# EAGLE design MEGA2560_Rev3e (EAGLE 9.6.2)

## Sheet 1 of 2
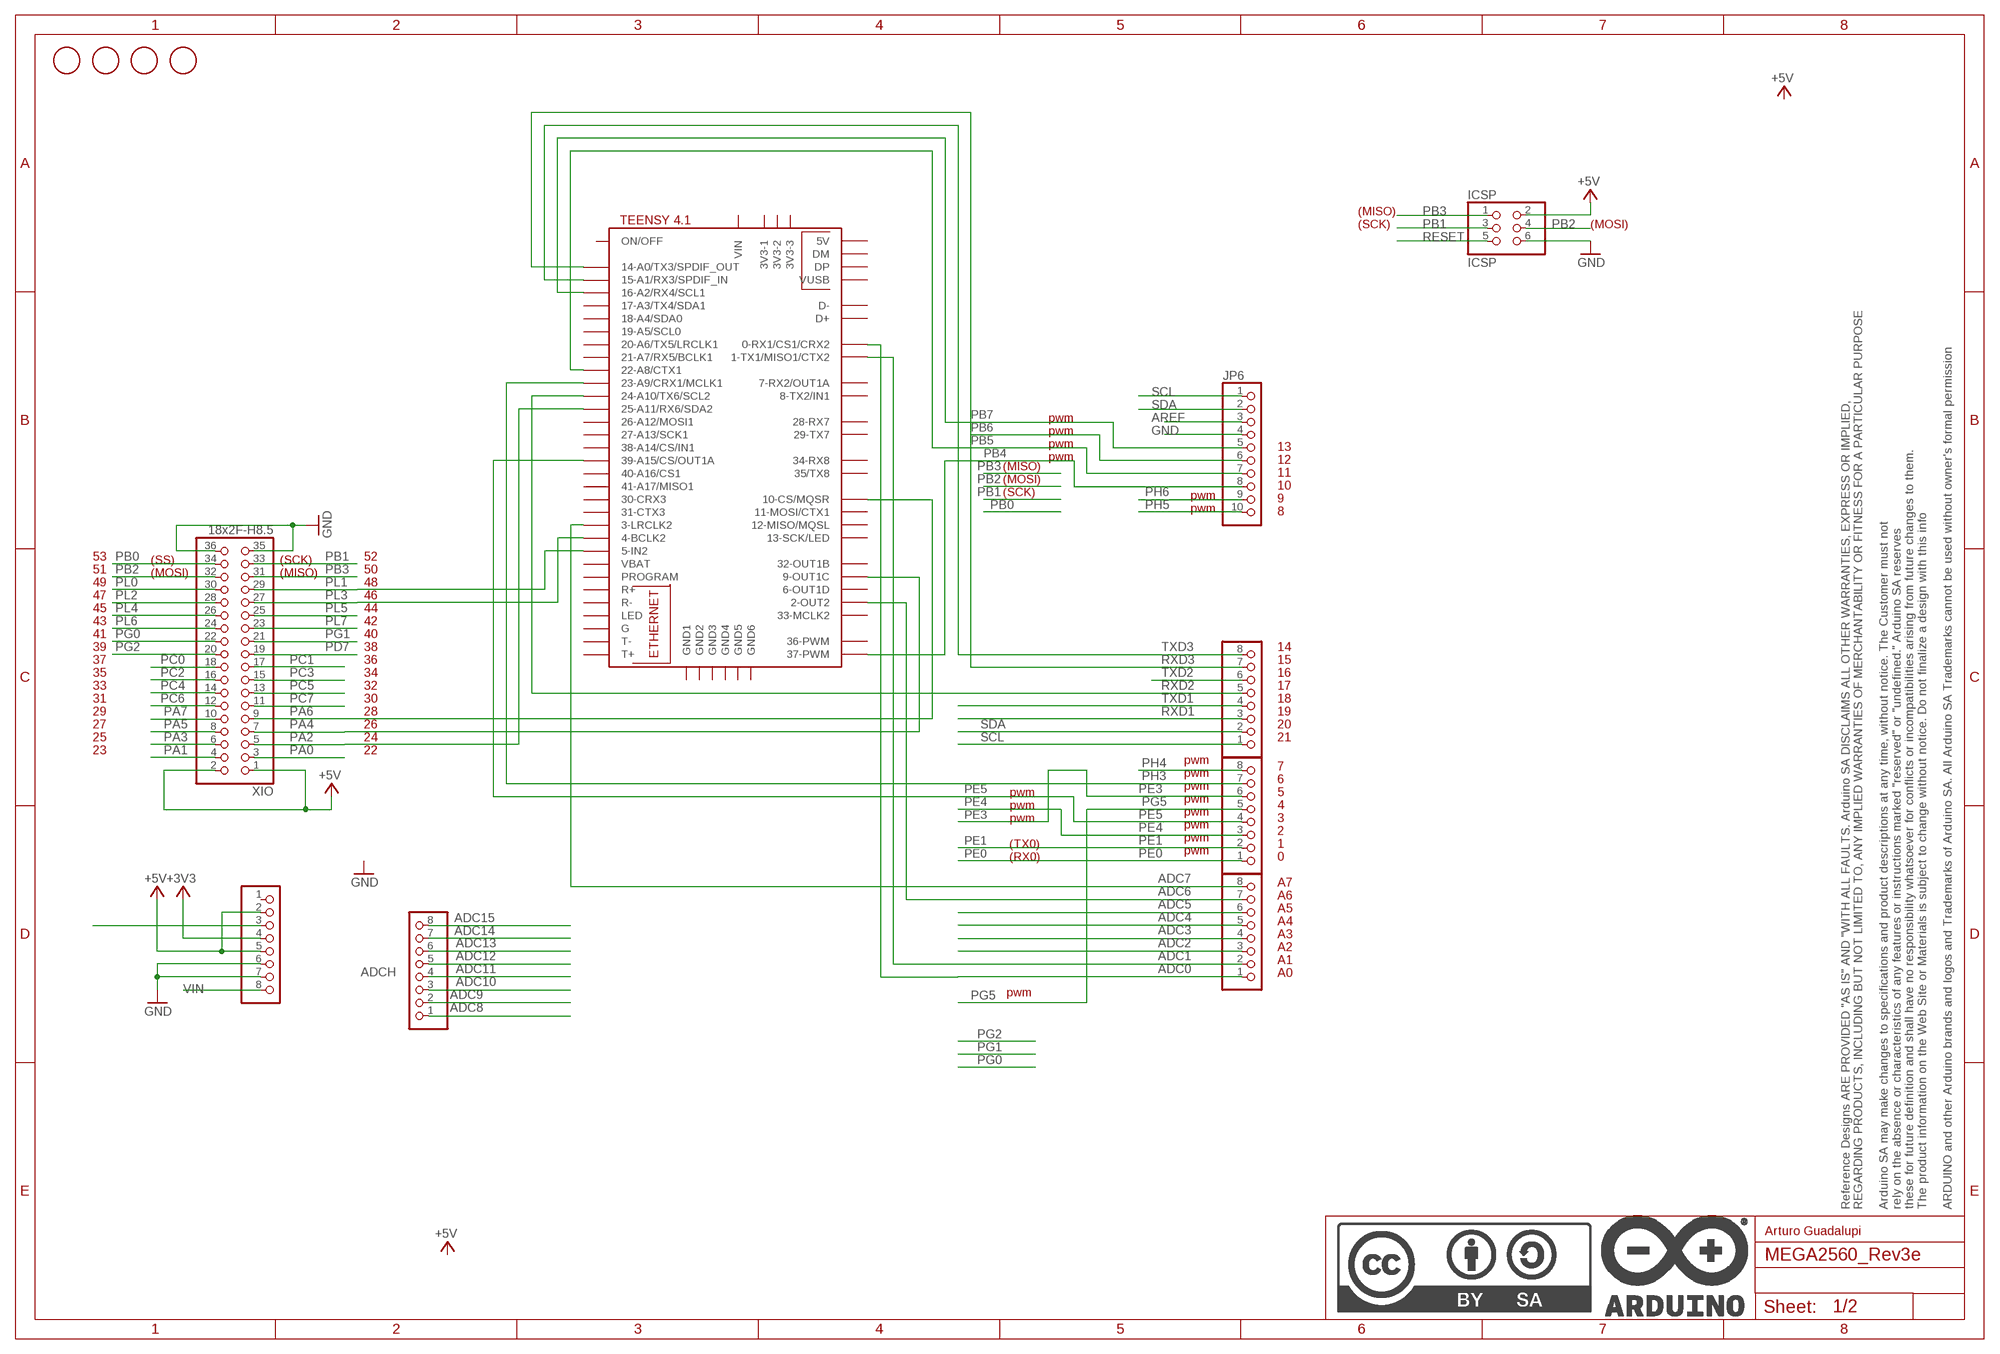
[diagram p0: schematic, sheet 1]

### Parts
ADCH  FH254-108DF08500V  0058_FH254-108DF08500V  [1X08]
ADCL  FH254-108DF08500V  0058_FH254-108DF08500V  [1X08]
COMMUNICATION  FH254-108DF08500V  0058_FH254-108DF08500V  [1X08]
FD1  FIDUCIALMOUNT  [FIDUCIA-MOUNT]
FD2  FIDUCIALMOUNT  [FIDUCIA-MOUNT]
FD3  FIDUCIALMOUNT  [FIDUCIA-MOUNT]
FD4  FIDUCIALMOUNT  [FIDUCIA-MOUNT]
ICSP  ICSP  0114_PH254-203DF118A00V  [2X03]
JP6  FH254-110DF08500V  1216_FH254-110DF08500T30  [1X10]
POWER  FH254-108DF08500V  1217_FH254-108DF08500T21  [1X08]
PWML  FH254-108DF08500V  1218_FH254-108DF08500T20  [1X08]
U$1  DNP  A3-FRAME  [FRAME]
U$3  TEENSY41  [TEENSY41]
XIO  18x2F-H8.5  0060_FH254-218DF08500V  [2X18]

### Nets
+3V3 [power]: POWER.4
+5V [power usb]: ICSP.2 POWER.2 POWER.5 XIO.1 XIO.2 ; also sheet 2
ADC0: ADCL.1 U$3.0-RX1/CS1/CRX2
ADC1: ADCL.2 U$3.1-TX1/MISO1/CTX2
ADC2: ADCL.3
ADC3: ADCL.4
ADC4: ADCL.5
ADC5: ADCL.6
ADC6: ADCL.7 U$3.2-OUT2
ADC7: ADCL.8 U$3.3-LRCLK2
ADC8: ADCH.1
ADC9: ADCH.2
ADC10: ADCH.3
ADC11: ADCH.4
ADC12: ADCH.5
ADC13: ADCH.6
ADC14: ADCH.7
ADC15: ADCH.8
AREF: JP6.3
GND [gnd]: ICSP.6 JP6.4 POWER.6 POWER.7 XIO.35 XIO.36 ; also sheet 2
PA0: XIO.3
PA1: XIO.4
PA2: U$3.25-A11/RX6/SDA2 XIO.5
PA3: XIO.6
PA4: U$3.9-OUT1C XIO.7
PA5: XIO.8
PA6: U$3.10-CS\MQSR(10-CS/MQSR) XIO.9
PA7: XIO.10
PB0: XIO.34
PB1: ICSP.3 XIO.33
PB2: ICSP.4 XIO.32
PB3: ICSP.1 XIO.31
PB4: JP6.8 U$3.37-PWM
PB5: JP6.7 U$3.22-A8/CTX1
PB6: JP6.6
PB7: JP6.5 U$3.16-A2/RX4/SCL1
PC0: XIO.18
PC1: XIO.17
PC2: XIO.16
PC3: XIO.15
PC4: XIO.14
PC5: XIO.13
PC6: XIO.12
PC7: XIO.11
PD7: XIO.19
PE0: PWML.1
PE1: PWML.2
PE3: PWML.6
PE4: PWML.3
PE5: PWML.4 U$3.39-A15/CS/OUT1A
PG0: XIO.22
PG1: XIO.21
PG2: XIO.20
PG5: PWML.5
PH3: PWML.7 U$3.23-A9/CRX1/MCLK1
PH4: PWML.8
PH5: JP6.10
PH6: JP6.9
PL0: XIO.30
PL1: U$3.5-IN2 XIO.29
PL2: XIO.28
PL3: U$3.4-BCLK2 XIO.27
PL4: XIO.26
PL5: XIO.25
PL6: XIO.24
PL7: XIO.23
RESET: ICSP.5 POWER.3
RXD1: COMMUNICATION.3
RXD2: COMMUNICATION.5 U$3.24-A10/TX6/SCL2
RXD3: COMMUNICATION.7 U$3.14-A0/TX3/SPDIF_OUT
SCL: COMMUNICATION.1 JP6.1
SDA: COMMUNICATION.2 JP6.2
TXD1: COMMUNICATION.4
TXD2: COMMUNICATION.6
TXD3: COMMUNICATION.8 U$3.15-A1/RX3/SPDIF_IN
VIN [power]: POWER.8
Unconnected: POWER.1 U$3.3V3-1 U$3.3V3-2 U$3.3V3-3 U$3.6-OUT1D U$3.7-RX2/OUT1A U$3.8-TX2/IN1 U$3.11-MOSI/CTX1 U$3.12-MISO/MQSL U$3.13-SCK/LED U$3.17-A3/TX4/SDA1 U$3.18-A4/SDA0 U$3.19-A5/SCL0 U$3.20-A6/TX5/LRCLK1 U$3.21-A7/RX5/BCLK1 U$3.26-A12/MOSI1 U$3.27-A13/SCK1 U$3.28-RX7 U$3.29-TX7 U$3.30-CRX3 U$3.31-CTX3 U$3.32-OUT1B U$3.33-MCLK2 U$3.34-RX8 U$3.35-TX8(35/TX8) U$3.36-PWM U$3.38-A14/CS/IN1 U$3.40-A16/CS1 U$3.41-A17/MISO1 U$3.+5V(5V) U$3.D+ U$3.D- U$3.DM U$3.DP U$3.G U$3.GND1 U$3.GND2 U$3.GND3 U$3.GND4 U$3.GND5 U$3.GND6 U$3.LED U$3.ON/OFF U$3.PROGRAM U$3.R+ U$3.R- U$3.T+ U$3.T- U$3.VBAT U$3.VIN U$3.VUSB

### Notes on the sheet
- (MISO)
- (SCK) | (MOSI)
- pwm
- pwm
- pwm | 13
- pwm | 12
- (MISO)
- 11
- (MOSI)
- 10
- (SCK) | pwm
- 9
- pwm | 8
- 53 | (SS) | (SCK) | 52
- 51 | (MOSI) | (MISO) | 50
- 49 | 48
- 47 | 46
- 45 | 44
- 43 | 42
- 41 | 40
- 39 | 38 | 14
- 37 | 36 | 15
- 35 | 34 | 16
- 33 | 32 | 17
- 31 | 30 | 18
- 29 | 28 | 19
- 27 | 26 | 20
- 25 | 24 | 21
- 23 | 22
- pwm
- 7
- pwm
- 6
- pwm
- pwm | 5
- pwm
- pwm | 4
- pwm
- pwm | 3
- pwm
- 2
- pwm
- (TX0) | 1
- pwm
- (RX0) | 0
- A7
- A6
- A5
- A4
- A3
- A2
- A1
- A0
- pwm
- Arturo Guadalupi

## Sheet 2 of 2
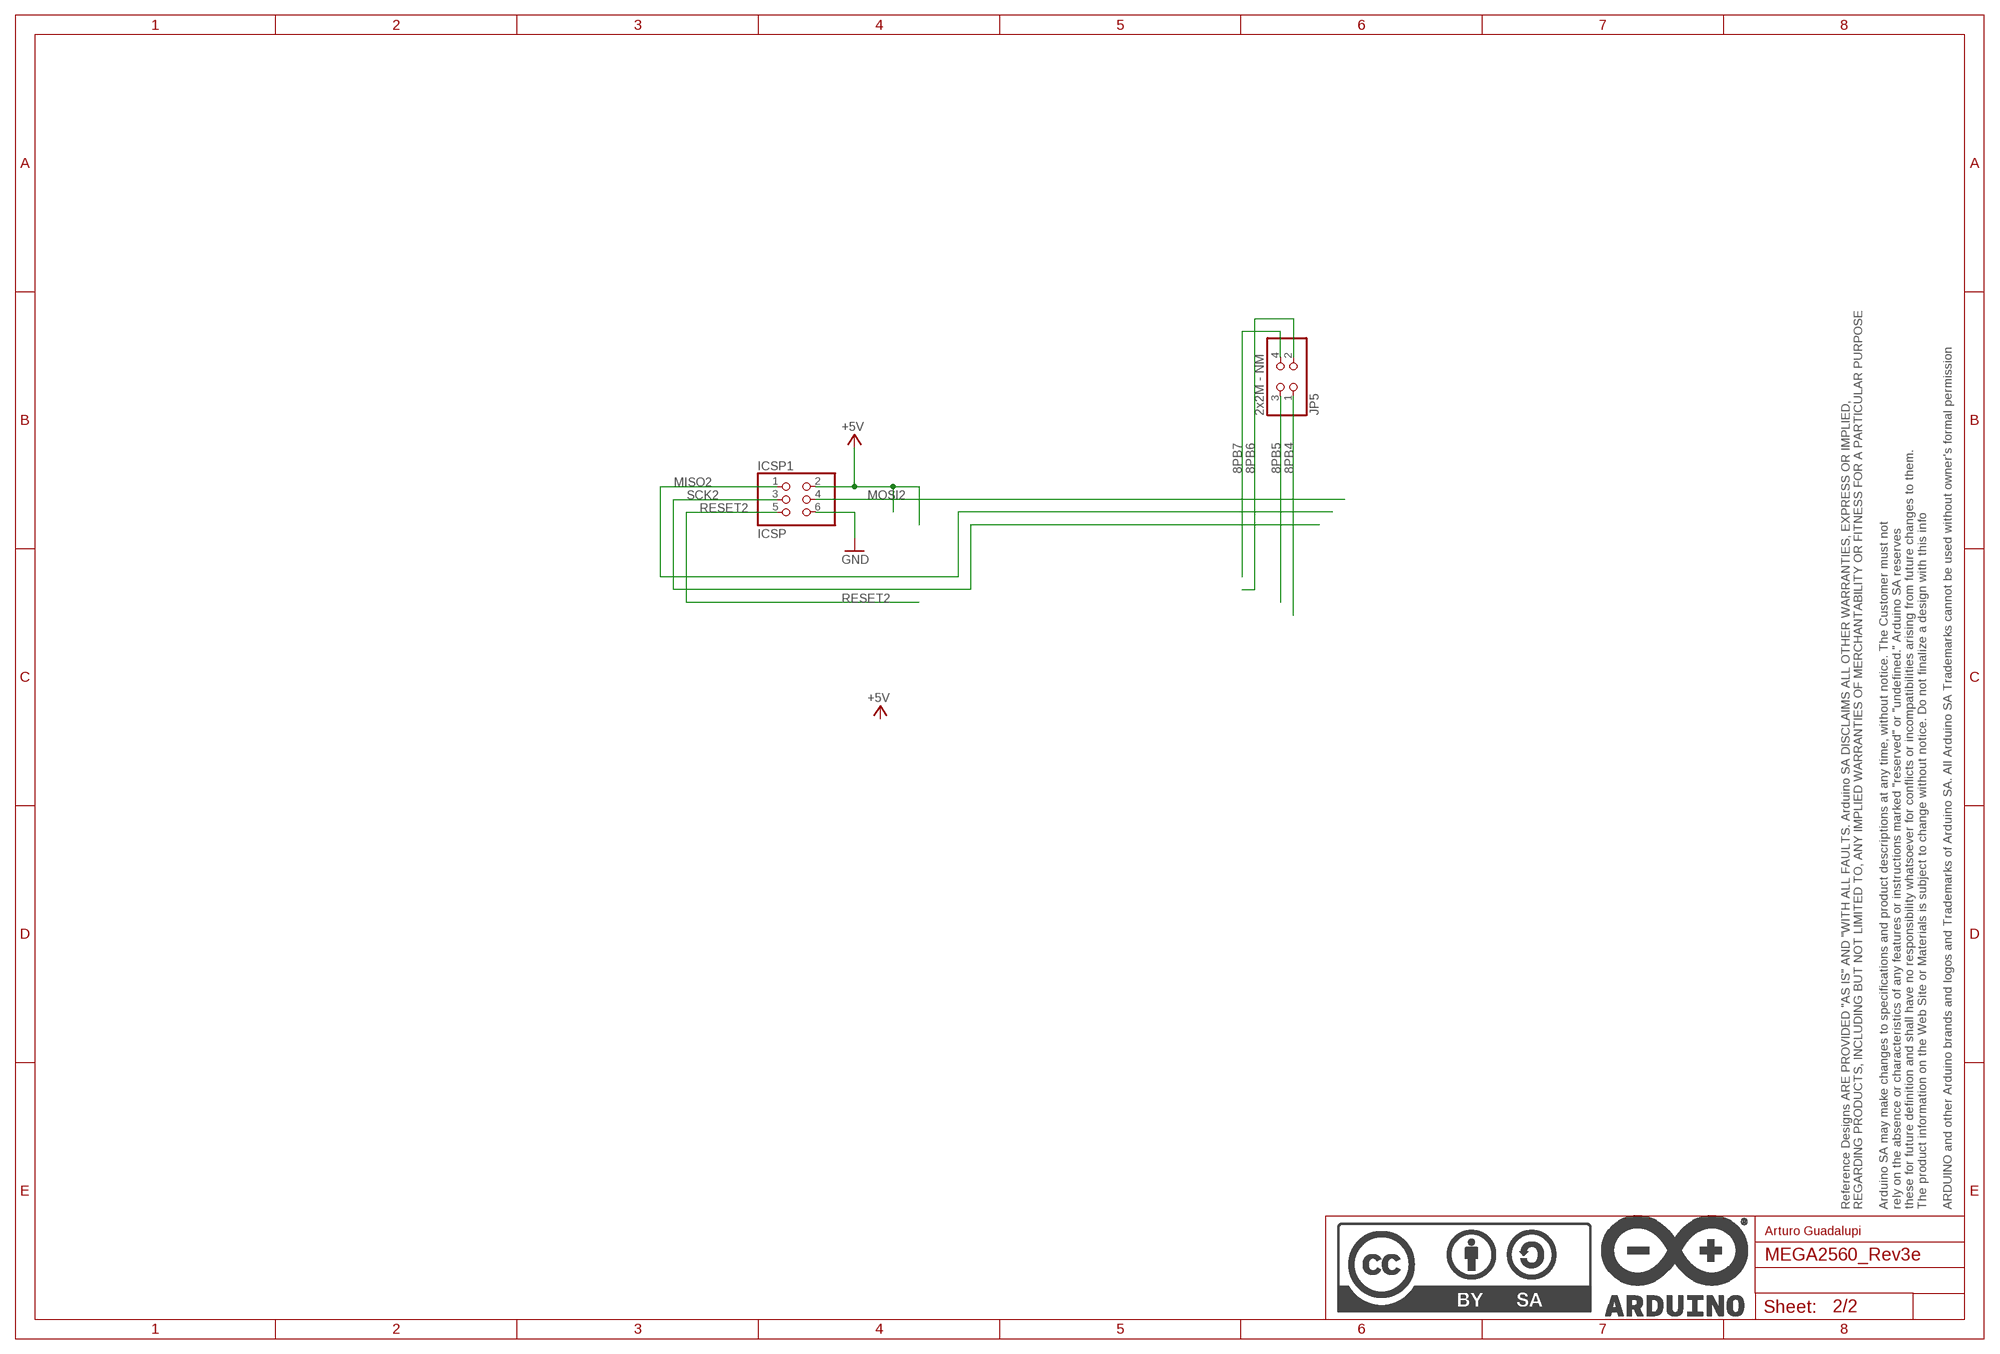
[diagram p1: schematic, sheet 2]

### Parts
ICSP1  ICSP  0114_PH254-203DF118A00V  [2X03]
JP5  2x2M - NM  PINHD-2X2  [2X02]
U$2  DNP  A3-FRAME  [FRAME]

### Nets
8PB4: JP5.1
8PB5: JP5.3
8PB6: JP5.2
8PB7: JP5.4
+5V [power usb]: ICSP1.2 ; also sheet 1
GND [gnd]: ICSP1.6 ; also sheet 1
MISO2: ICSP1.1
MOSI2: ICSP1.4
RESET2: ICSP1.5
SCK2: ICSP1.3

### Notes on the sheet
- Arturo Guadalupi

## Library data of the parts
ADCH ADCL COMMUNICATION = Connettori:0058_FH254-108DF08500V: Female Connector strip for Arduino bases - 8x1 F V h 8,5 p2,54mm; MONTHLY_USAGE: _____; PART_NUMBER: FH254-108DF08500V; PRICE: _____; SUPPLIER: _____; TYPE: Connettori
FD1-FD4 = SmartPrj:FIDUCIALMOUNT
ICSP ICSP1 = Connettori:0114_PH254-203DF118A00V: 3x2 M V h 8,5 mm p2,54; MONTHLY_USAGE: _____; PART_NUMBER: PH254-203DF118A00V; PRICE: _____; SUPPLIER: _____; TYPE: Connettori
JP5 = SmartPrj:PINHD-2X2: PIN HEADER
JP6 = Connettori:1216_FH254-110DF08500T30: Female Connector strip for Arduino bases - 10x1 F V h 8,5 p2,54 serigrafato STRISCIA VUOTA; MONTHLY_USAGE: _____; PART_NUMBER: FH254-110DF08500T30; PRICE: _____; SUPPLIER: _____; TYPE: Connettori; VALUE: FH254-110DF08500T30
POWER = Connettori:1217_FH254-108DF08500T21: Female Connector strip for Arduino bases - 8x1 F V h 8,5 p2,54 serigrafato POWER; MONTHLY_USAGE: _____; PART_NUMBER: FH254-108DF08500T21; PRICE: _____; SUPPLIER: _____; TYPE: Connettori; VALUE: FH254-108DF08500T21
PWML = Connettori:1218_FH254-108DF08500T20: Female Connector strip for Arduino bases - 8x1 F V h 8,5 p2,54 serigrafato DIGITAL; MONTHLY_USAGE: _____; PART_NUMBER: FH254-108DF08500T20; PRICE: _____; SUPPLIER: _____; TYPE: Connettori; VALUE: FH254-108DF08500T20
U$1 U$2 = Arduino-utility:A3-FRAME; CODE-ARDUINO: DNP; DATASHEET: DNP; DISTRIBUTOR-LINK: DNP; DISTRIBUTOR-PN: DNP; MANUFACTURER: DNP; MANUFACTURER-PN: DNP; NOTE: DNP
U$3 = teensy:TEENSY41
XIO = Connettori:0060_FH254-218DF08500V: 18x2 F V h 8,5 p2,54; MONTHLY_USAGE: _____; PART_NUMBER: FH254-218DF08500V; PRICE: _____; SUPPLIER: _____; TYPE: Connettori

## Net classes
0 default: width 0.203 mm, drill 0.406 mm, clearance 0.203 mm
1 power: width 0.61 mm, drill 0.406 mm, clearance 0.203 mm
2 gnd: width 0.305 mm, drill 0.406 mm, clearance 0.203 mm
3 power usb: width 0.508 mm, drill 0.406 mm, clearance 0.203 mm

## Board
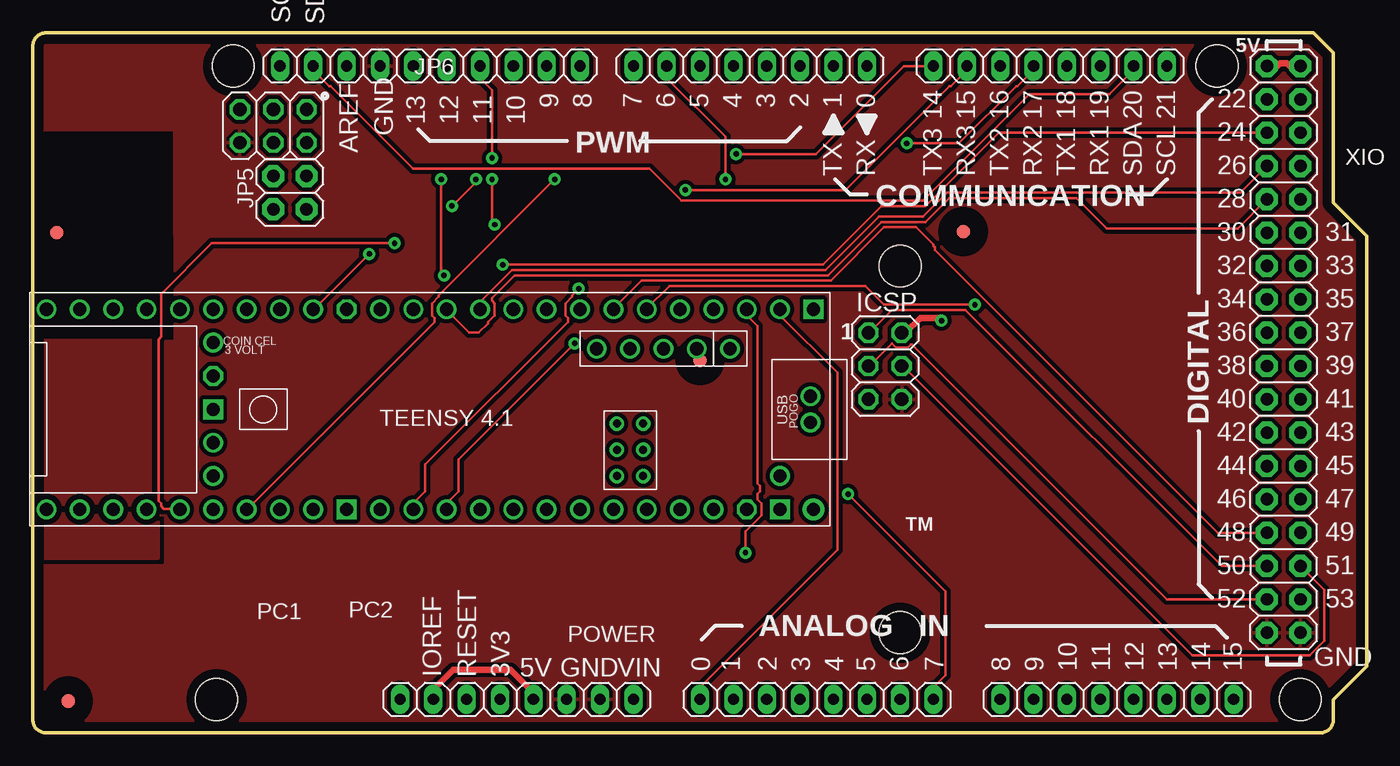
[diagram p2: board, top side]
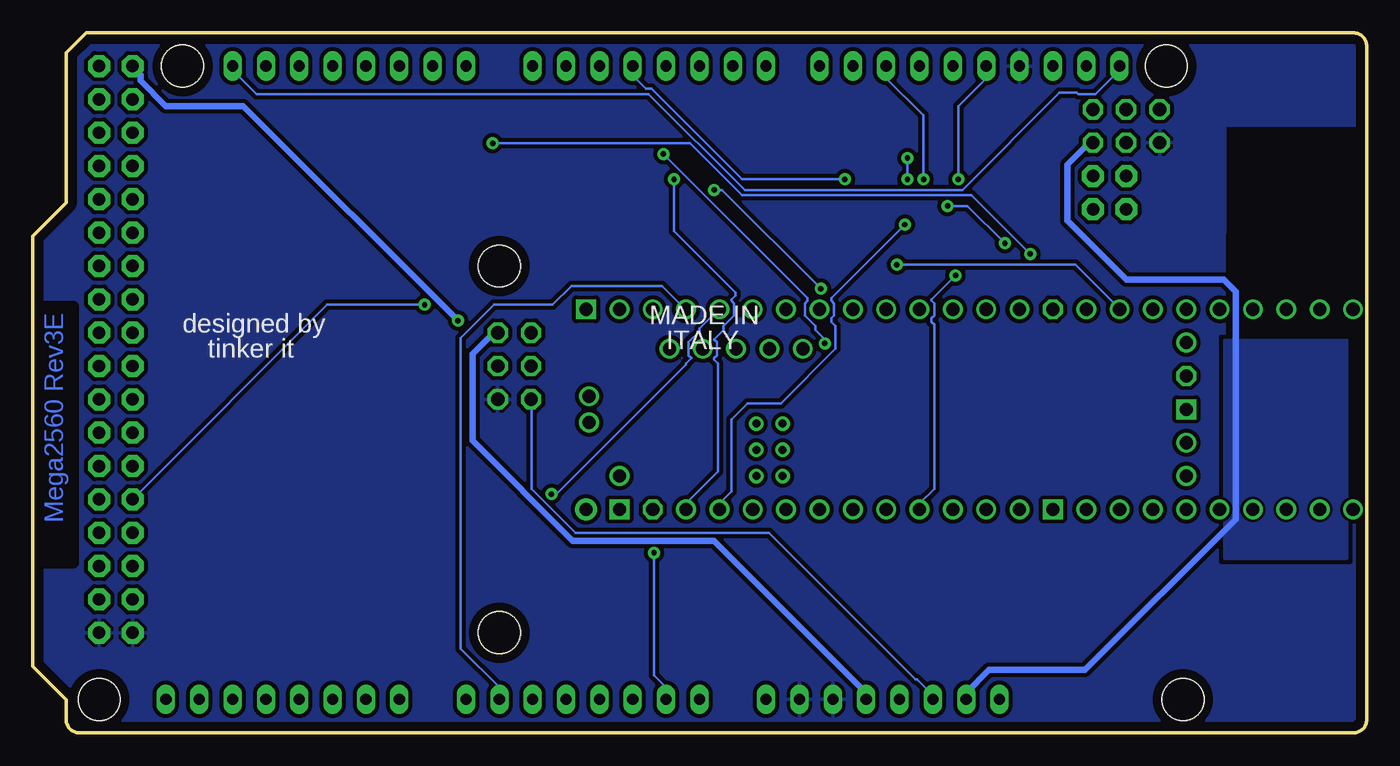
[diagram p3: board, bottom side, seen from below]

Size 101.6 x 53.34 mm. Coordinates in mm from the lower left corner, seen from the top.
Outline: 97.54,53.34 99.06,51.82 99.06,40.39 101.6,37.85 101.6,5.08 99.06,2.54 99.06,1 arc-90 98.06,0 1,0 arc-90 0,1 0,52.34 arc-90 1,53.34 97.54,53.34
Copper layers (1*16): Top 0.035mm / dielectric 1.5mm / Bottom 0.035mm
Design rules "ArduinoMega *": minimum track width 8mil, minimum drill 16mil, track to track 7mil, track to pad 7mil, pad to pad 8mil, via to via 10mil, smd to smd 7mil, copper to edge 27mil, drill to drill 12mil, minimum pad ring 10mil, minimum via ring 10mil, stop-mask expansion 2mil, vias tented up to drill 24mil, thermal gap 10mil
Holes 3.2 mm at 96.55,2.55 15.27,50.81 90.2,50.81 14,2.55 66.07,35.57 66.07,7.63
tRestrict: area 42.5,37.2 to 42.9,37.4
bRestrict: 3 lines

### Footprints (pad centres in the part's own frame; a part is rotated, then mirrored left to right if it is on the bottom)
1X08 = drill 0.85 pad 1.422 long: 1 -8.89,0; 2 -6.35,0; 3 -3.81,0; 4 -1.27,0; 5 1.27,0; 6 3.81,0; 7 6.35,0; 8 8.89,0
FIDUCIA-MOUNT = smd 1.016 x 1.016: P$1 0,0
2X03 = drill 1.016 pad 1.55 octagon: 1 -2.54,-1.27; 2 -2.54,1.27; 3 0,-1.27; 4 0,1.27; 5 2.54,-1.27; 6 2.54,1.27
2X02 = drill 0.95 pad 1.676 octagon: 1 -1.27,-1.27; 2 -1.27,1.27; 3 1.27,-1.27; 4 1.27,1.27
1X10 = drill 0.85 pad 1.422 long: 1 -11.43,0; 2 -8.89,0; 3 -6.35,0; 4 -3.81,0; 5 -1.27,0; 6 1.27,0; 7 3.81,0; 8 6.35,0; 9 8.89,0; 10 11.43,0
TEENSY41 = drill 1: 0-RX1/CS1/CRX2 -27.94,-7.62; 1-TX1/MISO1/CTX2 -25.4,-7.62; 2-OUT2 -22.86,-7.62; 3-LRCLK2 -20.32,-7.62; 4-BCLK2 -17.78,-7.62; 5-IN2 -15.24,-7.62; 6-OUT1D -12.7,-7.62; 7-RX2/OUT1A -10.16,-7.62; 8-TX2/IN1 -7.62,-7.62; 9-OUT1C -5.08,-7.62; 10-CS\MQSR -2.54,-7.62; 11-MOSI/CTX1 0,-7.62; 12-MISO/MQSL 2.54,-7.62; 13-SCK/LED 2.54,7.62; 14-A0/TX3/SPDIF_OUT 0,7.62; 15-A1/RX3/SPDIF_IN -2.54,7.62; 16-A2/RX4/SCL1 -5.08,7.62; 17-A3/TX4/SDA1 -7.62,7.62; 18-A4/SDA0 -10.16,7.62; 19-A5/SCL0 -12.7,7.62; 20-A6/TX5/LRCLK1 -15.24,7.62; 21-A7/RX5/BCLK1 -17.78,7.62; 22-A8/CTX1 -20.32,7.62; 23-A9/CRX1/MCLK1 -22.86,7.62; 24-A10/TX6/SCL2 7.62,-7.62; 25-A11/RX6/SDA2 10.16,-7.62; 26-A12/MOSI1 12.7,-7.62; 27-A13/SCK1 15.24,-7.62; 28-RX7 17.78,-7.62; 29-TX7 20.32,-7.62; 30-CRX3 22.86,-7.62; 31-CTX3 25.4,-7.62; 32-OUT1B 27.94,-7.62; 33-MCLK2 27.94,7.62; 34-RX8 25.4,7.62; 35-TX8 22.86,7.62; 36-PWM 20.32,7.62; 37-PWM 17.78,7.62; 38-A14/CS/IN1 15.24,7.62; 39-A15/CS/OUT1A 12.7,7.62; 40-A16/CS1 10.16,7.62; 41-A17/MISO1 7.62,7.62; +5V -24.13,-4.62; D+ -30.25,-1; D- -30.25,1; DM -21.59,-4.62; DP -19.05,-4.62; GND4 -16.51,-4.62; GND5 -13.97,-4.62; ON/OFF 15.24,5.08; PROGRAM 15.24,2.54; VBAT 15.24,-5.08; VUSB -27.94,5.08 | drill 1 octagon: 3V3-1 5.08,-7.62; 3V3-2 15.24,-2.54; 3V3-3 -25.4,7.62 | drill 0.6: G -15.51,3.08; LED -17.51,3.08; R+ -17.51,5.08; R- -15.51,5.08; T+ -15.51,1.08; T- -17.51,1.08 | drill 1 square: GND1 -30.48,-7.62; GND2 15.24,0; GND3 5.08,7.62; GND6 -27.94,7.62 | drill 1 pad 1.676: VIN -30.48,7.62
2X18 = drill 0.95 pad 1.676 octagon: 1 -21.59,-1.27; 2 -21.59,1.27; 3 -19.05,-1.27; 4 -19.05,1.27; 5 -16.51,-1.27; 6 -16.51,1.27; 7 -13.97,-1.27; 8 -13.97,1.27; 9 -11.43,-1.27; 10 -11.43,1.27; 11 -8.89,-1.27; 12 -8.89,1.27; 13 -6.35,-1.27; 14 -6.35,1.27; 15 -3.81,-1.27; 16 -3.81,1.27; 17 -1.27,-1.27; 18 -1.27,1.27; 19 1.27,-1.27; 20 1.27,1.27; 21 3.81,-1.27; 22 3.81,1.27; 23 6.35,-1.27; 24 6.35,1.27; 25 8.89,-1.27; 26 8.89,1.27; 27 11.43,-1.27; 28 11.43,1.27; 29 13.97,-1.27; 30 13.97,1.27; 31 16.51,-1.27; 32 16.51,1.27; 33 19.05,-1.27; 34 19.05,1.27; 35 21.59,-1.27; 36 21.59,1.27

### Placement (x,y rotation side)
ADCH  82.58,2.55 0 top
ADCL  59.72,2.55 0 top
COMMUNICATION  77.5,50.81 180 top
FD1  70.87,38.2 0 top
FD2  2.69,2.43 0 top
FD3  1.8,38.11 0 top
FD4  50.83,28.36 0 top
ICSP  64.92,27.95 270 top
ICSP1  18.31,46.24 180 top
JP5  19.58,41.16 90 top
JP6  30.25,50.81 0 top
POWER  36.86,2.55 0 top
PWML  54.64,50.81 180 top
U$1  0.03,0.01 0 top
U$2  0.03,0.01 0 top
U$3  28.98,24.65 180 top
XIO  95.28,29.22 270 top

### Tracks (layer width: path | path; a pad name or v marks a point on that pad's centre or on a via)
+5V  (via drill 0.41)
  Top 0.508: ICSP.2 66.47,30.49 67.59,31.61 69.01,31.61 v69.22,31.41 | XIO.2 95.73,50.81 95.53,51.02 95.02,51.02 94.62,50.61 94.21,50.61 XIO.1 | POWER.2 30.51,3.26 32.03,4.79 36.4,4.79 38.13,3.06 POWER.5
  Bottom 0.508: v69.22,31.41 85.57,47.76 91.47,47.76 93.4,49.69 93.4,50.1 94.01,50.71 XIO.1 | POWER.2 30.51,3.06 28.78,4.79 21.46,4.79 9.98,16.27 9.98,33.64 10.9,34.56 18.31,34.56 22.78,39.03 22.78,43.29 21.16,44.92 20.85,44.92 ICSP1.2 | ICSP.2 66.47,30.49 68.1,28.87 68.1,22.26 60.48,14.64 49.71,14.64 38.13,3.06 POWER.5
  pour Top (isolate 0.406, no thermals): 9.55,13.35 9.55,29.86 0.66,29.86 0.66,13.35
  pour Bottom: 1.5,13.35 1.5,29.86 10.82,29.86 10.82,13.35
ADC0
  Top 0.203: ADCL.1 50.83,3.47 61.29,13.93 61.29,27.44 56.92,31.81 U$3.0-RX1/CS1/CRX2
ADC1  (via drill 0.41)
  Top 0.203: v54.28,13.73 54.28,15.35 55.5,16.57 55.5,17.49 55.19,17.79 55.19,18.2 55.4,18.4 55.4,18.81 55.19,19.01 55.19,31 54.38,31.81 U$3.1-TX1/MISO1/CTX2
  Bottom 0.203: ADCL.2 53.37,3.47 54.28,4.38 v54.28,13.73
ADC6
  Bottom 0.203: ADCL.7 66.07,3.47 69.01,6.41 69.01,30.09 66.47,32.63 62,32.63 60.58,34.05 53.67,34.05 51.84,32.22 U$3.2-OUT2
ADC7  (via drill 0.41)
  Top 0.203: ADCL.8 68.61,3.47 69.52,4.38 69.52,10.78 v62.1,18.2
  Bottom 0.203: v62.1,18.2 61.7,18.2 51.84,28.05 51.84,28.16 51.44,28.56 51.64,28.77 51.64,29.78 50.83,30.59 50.83,30.8 49.3,32.32 U$3.3-LRCLK2
GND
  pour Top (isolate 0.305, rank 2): 0.36,52.72 101.63,52.72 101.63,0.65 0.66,0.65 0.66,29.86 10.82,29.86 10.77,45.91 0.3,45.91
  pour Bottom (isolate 0.305, rank 2): 0.66,52.72 101.63,52.72 102.26,52.08 102.26,0.65 1.3,0.65 0.66,1.28 0.66,29.86 10.82,29.86 10.77,46.27 0.61,46.27
PA2  (via drill 0.41)
  Top 0.203: v35.79,35.67 60.17,35.67 64.64,40.14 68,40.14 73.58,45.73 XIO.5
  Bottom 0.203: v35.79,35.67 22.17,35.67 18.82,32.32 U$3.25-A11/RX6/SDA2
PA4
  Top 0.203: U$3.9-OUT1C 34.06,32.83 36.5,35.27 60.38,35.27 64.44,39.33 67.79,39.33 69.62,41.16 91.97,41.16 XIO.7
PA6
  Top 0.203: XIO.9 91.77,38.42 81.81,38.42 79.48,40.75 69.82,40.75 68,38.93 64.64,38.93 60.58,34.86 36.7,34.86 34.98,33.13 34.98,32.93 35.18,32.73 35.18,31.81 34.67,31.31 34.67,31.2 33.96,30.49 33.25,30.49 31.52,32.22 U$3.10-CS\MQSR
PB1
  Top 0.203: XIO.33 86.39,10.17 66.98,29.58 66.88,29.58 66.68,29.37 65.76,29.37 65.46,29.68 63.73,27.95 ICSP.3
PB2
  Top 0.203: XIO.32 98.37,10.88 98.37,7.02 97.26,5.91 88.32,5.91 66.27,27.95 ICSP.4
PB3
  Top 0.203: XIO.31 90.55,12.71 71.04,32.22 65.46,32.22 63.73,30.49 ICSP.1
PB4  (via drill 0.41)
  Top 0.203: v33.76,42.18 33.76,41.97 v31.93,40.14 | v27.56,37.3 13.64,37.3 9.78,33.44 9.78,30.19 9.58,29.98 9.58,17.69 9.78,17.49 9.78,17.28 9.98,17.08 11.2,17.08 U$3.37-PWM
  Bottom 0.203: JP6.8 36.6,49.9 33.76,47.05 v33.76,42.18 | v31.93,40.14 30.4,40.14 v27.56,37.3
PB5  (via drill 0.41)
  Top 0.203: JP6.7 34.06,49.9 34.98,48.98 v34.98,43.8 | v34.98,42.18 34.98,38.93 v35.18,38.72
  Bottom 0.203: v34.98,42.18 v34.98,43.8 | v35.18,38.72 40.77,33.13 40.77,32.93 40.56,32.73 40.56,31.81 40.77,31.61 40.77,31.31 40.46,31 40.46,29.27 44.63,25.11 47.17,25.11 48.39,23.89 48.39,18.4 49.3,17.49 U$3.22-A8/CTX1
PB7  (via drill 0.41)
  Top 0.203: v31.12,42.18 31.12,35.06 v31.32,34.86
  Bottom 0.203: JP6.5 28.98,49.9 31.12,47.76 v31.12,42.18 | v31.32,34.86 33.15,33.03 33.15,32.93 32.94,32.73 32.94,31.81 33.15,31.61 33.15,31.31 32.94,31.1 32.94,18.61 34.06,17.49 U$3.16-A2/RX4/SCL1
PE5  (via drill 0.41)
  Top 0.203: v39.75,42.18 30.91,33.34 30.91,33.24 30.4,32.73 30.4,31.81 30.61,31.61 30.61,31.31 16.28,16.98 U$3.39-A15/CS/OUT1A
  Bottom 0.203: PWML.4 55.91,50.1 54.89,49.09 54.48,49.09 47.57,42.18 v39.75,42.18
PH3  (via drill 0.41)
  Top 0.203: PWML.7 48.29,49.9 52.76,45.43 v52.76,42.18
  Bottom 0.203: v52.76,42.18 52.76,38.21 48.08,33.54 48.08,33.34 48.39,33.03 48.39,32.93 48.18,32.73 48.18,31.81 49,31 49,30.7 49.71,29.98 49.5,29.78 49.5,28.77 49.71,28.56 49.71,28.46 49.4,28.16 49.4,19.93 51.84,17.49 U$3.23-A9/CRX1/MCLK1
PL1
  Top 0.203: XIO.29 90.25,15.25 68.71,36.79 68.71,36.99 68.61,37.1 68.61,37.2 67.28,38.52 64.85,38.52 60.78,34.45 46.36,34.45 44.22,32.32 U$3.5-IN2
PL3  (via drill 0.41)
  Top 0.203: v71.76,32.63 64.85,32.63 63.42,34.05 48.49,34.05 46.76,32.32 U$3.4-BCLK2
  Bottom 0.203: v71.76,32.63 79.17,32.63 XIO.27
RESET
  Bottom 0.203: POWER.3 33.05,2.86 34.26,4.08 34.37,4.08 45.54,15.25 60.27,15.25 63.63,18.61 63.63,25.41 ICSP.5
RXD2  (via drill 0.41)
  Top 0.203: COMMUNICATION.5 76.23,50.51 75.01,49.29 74.9,49.29 70.54,44.92 v66.57,44.92 | v25.63,36.49 21.36,32.22 U$3.24-A10/TX6/SCL2
  Bottom 0.203: v66.57,44.92 51.54,44.92 47.57,40.96 30.1,40.96 v25.63,36.49
RXD3  (via drill 0.41)
  Top 0.203: COMMUNICATION.7 71.15,50.51 69.93,49.29 69.82,49.29 61.9,41.36 v49.71,41.36 | v41.58,33.85 41.07,33.34 41.07,33.24 40.56,32.73 40.56,31.81 40.77,31.61 40.77,31.31 29.9,20.43 29.9,18.4 28.98,17.49 U$3.14-A0/TX3/SPDIF_OUT
  Bottom 0.203: v49.71,41.36 49.1,41.36 v41.58,33.85
SCL
  Bottom 0.203: JP6.1 18.82,50.51 20.65,48.68 21.97,48.68 22.07,48.78 23.39,48.78 30.81,41.36 47.37,41.36 54.69,48.68 84.56,48.68 86.39,50.51 COMMUNICATION.1
SDA
  Top 0.203: JP6.2 21.36,50.51 22.58,49.29 22.68,49.29 28.98,42.99 46.96,42.99 49.4,40.55 67.79,40.55 75.92,48.68 82.02,48.68 83.85,50.51 COMMUNICATION.2
TXD3  (via drill 0.41)
  Top 0.203: COMMUNICATION.8 66.37,50.81 59.66,44.11 v53.57,44.11 | v41.28,29.68 32.44,20.84 32.44,18.4 31.52,17.49 U$3.15-A1/RX3/SPDIF_IN
  Bottom 0.203: v53.57,44.11 42.6,33.13 42.6,32.93 42.8,32.73 42.8,31.81 41.99,31 41.99,30.7 41.28,29.98 v41.28,29.68

### Text on the board
Bottom: Mega2560 Rev3E
tPlace: 9 | 8 | 7 | 6 | 5 | 4 | 3 | 2 | 1 | 0 | 22 | 14 | 15 | 16 | 17 | 18 | 19 | 20 | 21 | 13 | 12 | 11 | 10 | 24 | 26 | 28 | 30 | 31 | 32 | 33 | 34 | 35 | 36 | 37 | 38 | 39 | 40 | 41 | 42 | 43 | 44 | 45 | 46 | 47 | TM | 48 | 49 | 50 | 51 | 52 | 53 | 0 | 1 | 2 | 3 | 4 | 5 | 6 | 7 | 8 | 9 | 10 | 11 | 12 | 13 | 14 | 15
tNames: SCL | SDA | 5V | GND | AREF | PWM | TX | RX | TX3 | RX3 | TX2 | RX2 | TX1 | RX1 | SDA | SCL | 1 | DIGITAL | PC1 | PC2 | ANALOG IN | GND | IOREF | RESET | 3V3 | 5V | GND | VIN
bNames: MADE IN | designed by | ITALY | tinker it
ReferenceLC: L | ON
test-probe: SCL | SDA | AREF | GND3 | 13 | 12 | 11 | 10 | 9 | 8 | 7 | 6 | 5 | 4 | 3 | 2 | 1 | 0 | 14 | 15 | 16 | 17 | 18 | 19 | 20 | 21 | 5V_2 | 5V_3 | 22 | 23 | 24 | 25 | ISP2_6 | ISP2_4 | ISP2_2 | ISP2_1 | ISP2_3 | ISP2_5 | 26 | 27 | 28 | 29 | 30 | 31 | 32 | 33 | 34 | 35 | ISP1_1 | ISP1_2 | 36 | 37 | ISP1_3 | ISP1_4 | 38 | 39 | ISP1_5 | ISP1_6 | 40 | 41 | 42 | 43 | 44 | 45 | 46 | 47 | 48 | 49 | 50 | 51 | 52 | 53 | GND4 | GND5 | IOREF | RESET | 3V3 | 5V_1 | GND1 | GND2 | VIN | A0 | A1 | A2 | A3 | A4 | A5 | A6 | A7 | A8 | A9 | A10 | A11 | A12 | A13 | A14 | A15